# Altium schematic sheet LNA.SchDoc: LNA
size A4; DocumentNumber: 17; Revision: 1.8.2; SheetNumber: 17; SheetTotal: 19
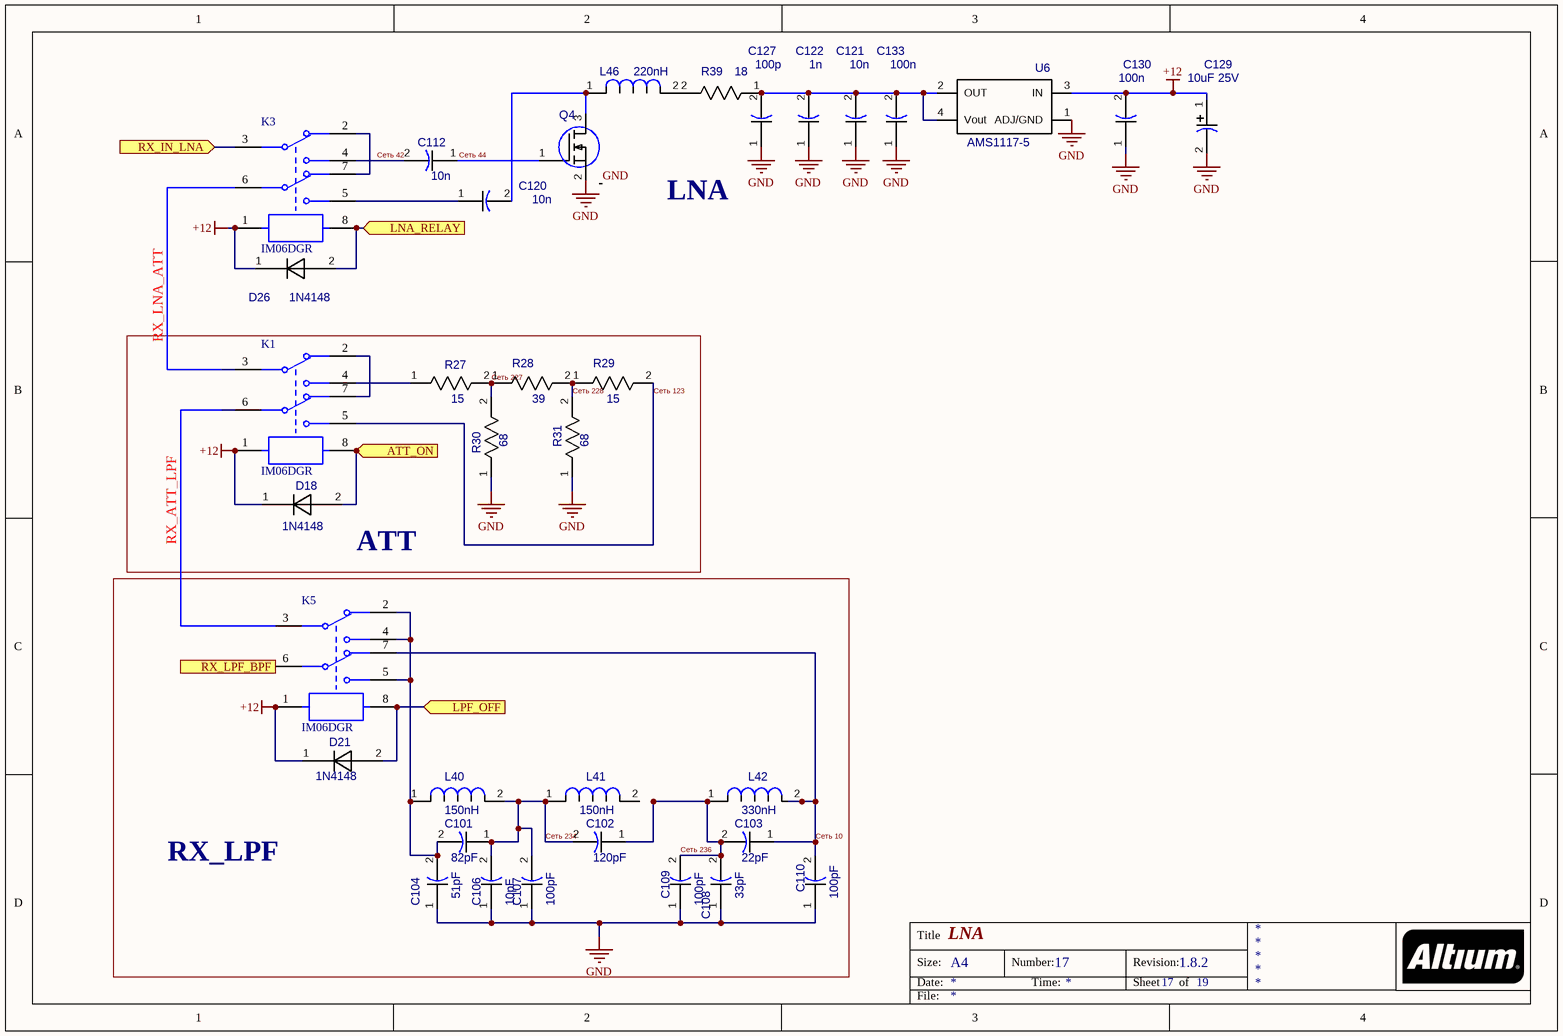
[diagram p0: LNA.SchDoc]

## Parts
C101  value 82pF  [CAP_0805]  (hidden comment: CAP_0805)
C102  value 120pF  [CAP_0805]  (hidden comment: CAP_0805)
C103  value 22pF  [CAP_0805]  (hidden comment: CAP_0805)
C104  value 51pF  [CAP_0805]  (hidden comment: CAP_0805)
C106  value 10pF  [CAP_0805]  (hidden comment: CAP_0805)
C107  value 100pF  [CAP_0805]  (hidden comment: CAP_0805)
C108  value 33pF  [CAP_0805]  (hidden comment: CAP_0805)
C109  value 100pF  [CAP_0805]  (hidden comment: CAP_0805)
C110  value 100pF  [CAP_0805]  (hidden comment: CAP_0805)
C112  value 10n  [CAP_0805]  (hidden comment: CAP_0805)
C120  value 10n  [CAP_0805]  (hidden comment: CAP_0805)
C121  value 10n  [6-0805_M]  (hidden comment: CAP_0805)
C122  value 1n  [6-0805_M]  (hidden comment: CAP_0805)
C127  value 100p  [6-0805_M]  (hidden comment: CAP_0805)
C129  value 10uF 25V  [CAPAE_5.3x5.3h6.1]  (hidden comment: CAPAE_5.3x5.3h6.1)
C130  value 100n  [CAP_0805]  (hidden comment: CAP_0805)
C133  value 100n  [CAP_0805]  (hidden comment: CAP_0805)
D18  1N4148  [1N4148]
D21  1N4148  [1N4148]
D26  1N4148  [1N4148]
K1  IM06DGR  [TECO-SMT-8_V]
K3  IM06DGR  [TECO-SMT-8_V]
K5  IM06DGR  [TECO-SMT-8_V]
L40  value 150nH  [IND_0805]  (hidden comment: IND_0805)
L41  value 150nH  [IND_0805]  (hidden comment: IND_0805)
L42  value 330nH  [IND_0805]  (hidden comment: IND_0805)
L46  value 220nH  [IND_1206]  (hidden comment: IND_1206)
Q4  PGA-103+  [SOT89]  (value not drawn)
R27  value 15  [RES_0805]  (hidden comment: RES_0805)
R28  value 39  [RES_0805]  (hidden comment: RES_0805)
R29  value 15  [RES_0805]  (hidden comment: RES_0805)
R30  value 68  [RES_0805]  (hidden comment: RES_0805)
R31  value 68  [RES_0805]  (hidden comment: RES_0805)
R39  value 18  [RES_1206]  (hidden comment: RES_1206)
U6  AMS1117-5  [AMS1117-5]

## Blocks framed on the sheet
ATT: D18 K1 R27-R31
RX_LPF: C101-C104 C106-C110 D21 K5 L40-L42

## Ports
ATT_ON (in), LNA_RELAY (in), LPF_OFF (in), RX_IN_LNA (in), RX_LPF_BPF (out)

## Nets
+12: C129.1(PLUS) C130.2 D18.1(K) D21.1(K) D26.1(K) K1.1 K3.1 K5.1 U6.3(IN)
GND: C104.1 C106.1 C107.1 C108.1 C109.1 C110.1 C121.1 C122.1 C127.1 C129.2(MINUS) C130.1 C133.1 Q4.0 Q4.2(S) R30.1 R31.1 U6.1(ADJ/GND)
ATT_ON: D18.2(A) K1.8 ; port ATT_ON
LNA_RELAY: D26.2(A) K3.8 ; port LNA_RELAY
LPF_OFF: D21.2(A) K5.8 ; port LPF_OFF
RX_IN_LNA: K3.3 ; port RX_IN_LNA
RX_LPF_BPF: K5.6 ; port RX_LPF_BPF
Сеть 10: C103.1 C110.2 K5.7 L42.2
Сеть 42: C112.2 K3.4
Сеть 44: C112.1 Q4.1(G)
Сеть 123: K1.5 R29.2
Сеть 227: R27.2 R28.1 R30.2
Сеть 228: R28.2 R29.1 R31.2
Сеть 234: C101.1 C102.2 C106.2 C107.2 L40.2 L41.1
Сеть 236: C102.1 C103.2 C108.2 C109.2 L42.1
NetC101_2: C101.2 C104.2 K5.2 K5.4 K5.5 L40.1
NetC120_1: C120.1 K3.5
NetC120_2: C120.2 L46.1 Q4.3(D)
NetC121_2: C121.2 C122.2 C127.2 C133.2 R39.1 U6.2(OUT) U6.4(Vout)
NetK1_2: K1.2 K1.7
NetK1_3: K1.3 K3.6
NetK1_4: K1.4 R27.1
NetK1_6: K1.6 K5.3
NetK3_2: K3.2 K3.7
NetL46_2: L46.2 R39.2

Not connected (* = marked no-connect by the designer): L41 2

## Notes on the sheet
- LNA
- RX_LNA_ATT
- RX_ATT_LPF
- Title
- Size:
- Date:
- A4
- Number:
- Time:
- Revision:
- Sheet
- of
- File:

## Library data of the parts
K1 K3 K5 = CMP-2000-05421-1: Signal Relay, 5 A, 12 VDC, -40 to 85 degC, 8-Pin SMD, RoHS, Tape and Reel; Manufacturer: TE Connectivity; Contact Voltage AC Nom: 250V; Approval Category: ULRecognised; Contact Current Max: 5A; Coil Type: DC; Coil Voltage VDC Nom: 12V; Dielectric Voltage Coil to Contact: 1800V; Switching Power Max: 62.5VA; Switching Voltage AC / DC Max: 250VAC; External Depth: 10mm; Approval Bodies: EN/IEC; No. of Pins: 8; Contact Configuration: DPCO; Contact Voltage DC Nom: 220V; Coil Resistance: 1.028kohm; Coil Power Cont: 140mW; Dielectric Voltage Contact to Contact: 1000V; Contact Current DC Max: 2A; Switching Voltage Max: 220VDC; Insulation Resistance: 1000Mohm; No. of Poles: 2; Switching Voltage AC / DC Min: 100µV; Contact Resistance: 50mohm; External Width: 6mm; Switch Power Max: 60W; Operating Voltage Range: 9Vto28.9V; Insulation Resistance Voltage: 500VDC; External Length / Height: 5.65mm; Relay Mounting: SMD; Package Reference: SMT-8; Datasheet URL: http://www.farnell.com/datasheets/1717896.pdf; Manufacturer URL: http://www.te.com/; Operating Temperature Max: 85degC; Series: IM; Mounting Type: SMT; Package Description: 8-Pin Surface Mount Device, Body 10 x 6 mm; DC Coil Power: 140mW; MSL: MSL3-168hours; Contact Current AC Max: 2A; Datasheet Version: Rev. 0411, 04/2011; Operating Temperature Min: -40degC; External Height: 5.65mm
Q4 = PGA-103+: MOSFET; Value: PGA-103+
D18 D21 D26 = 1N4148: Value: 1N4148
U6 = AMS1117-5: Value: AMS1117-5